# Altium schematic sheet MCU_Core.SchDoc
size A3; SheetNumber: 3; SheetTotal: 5
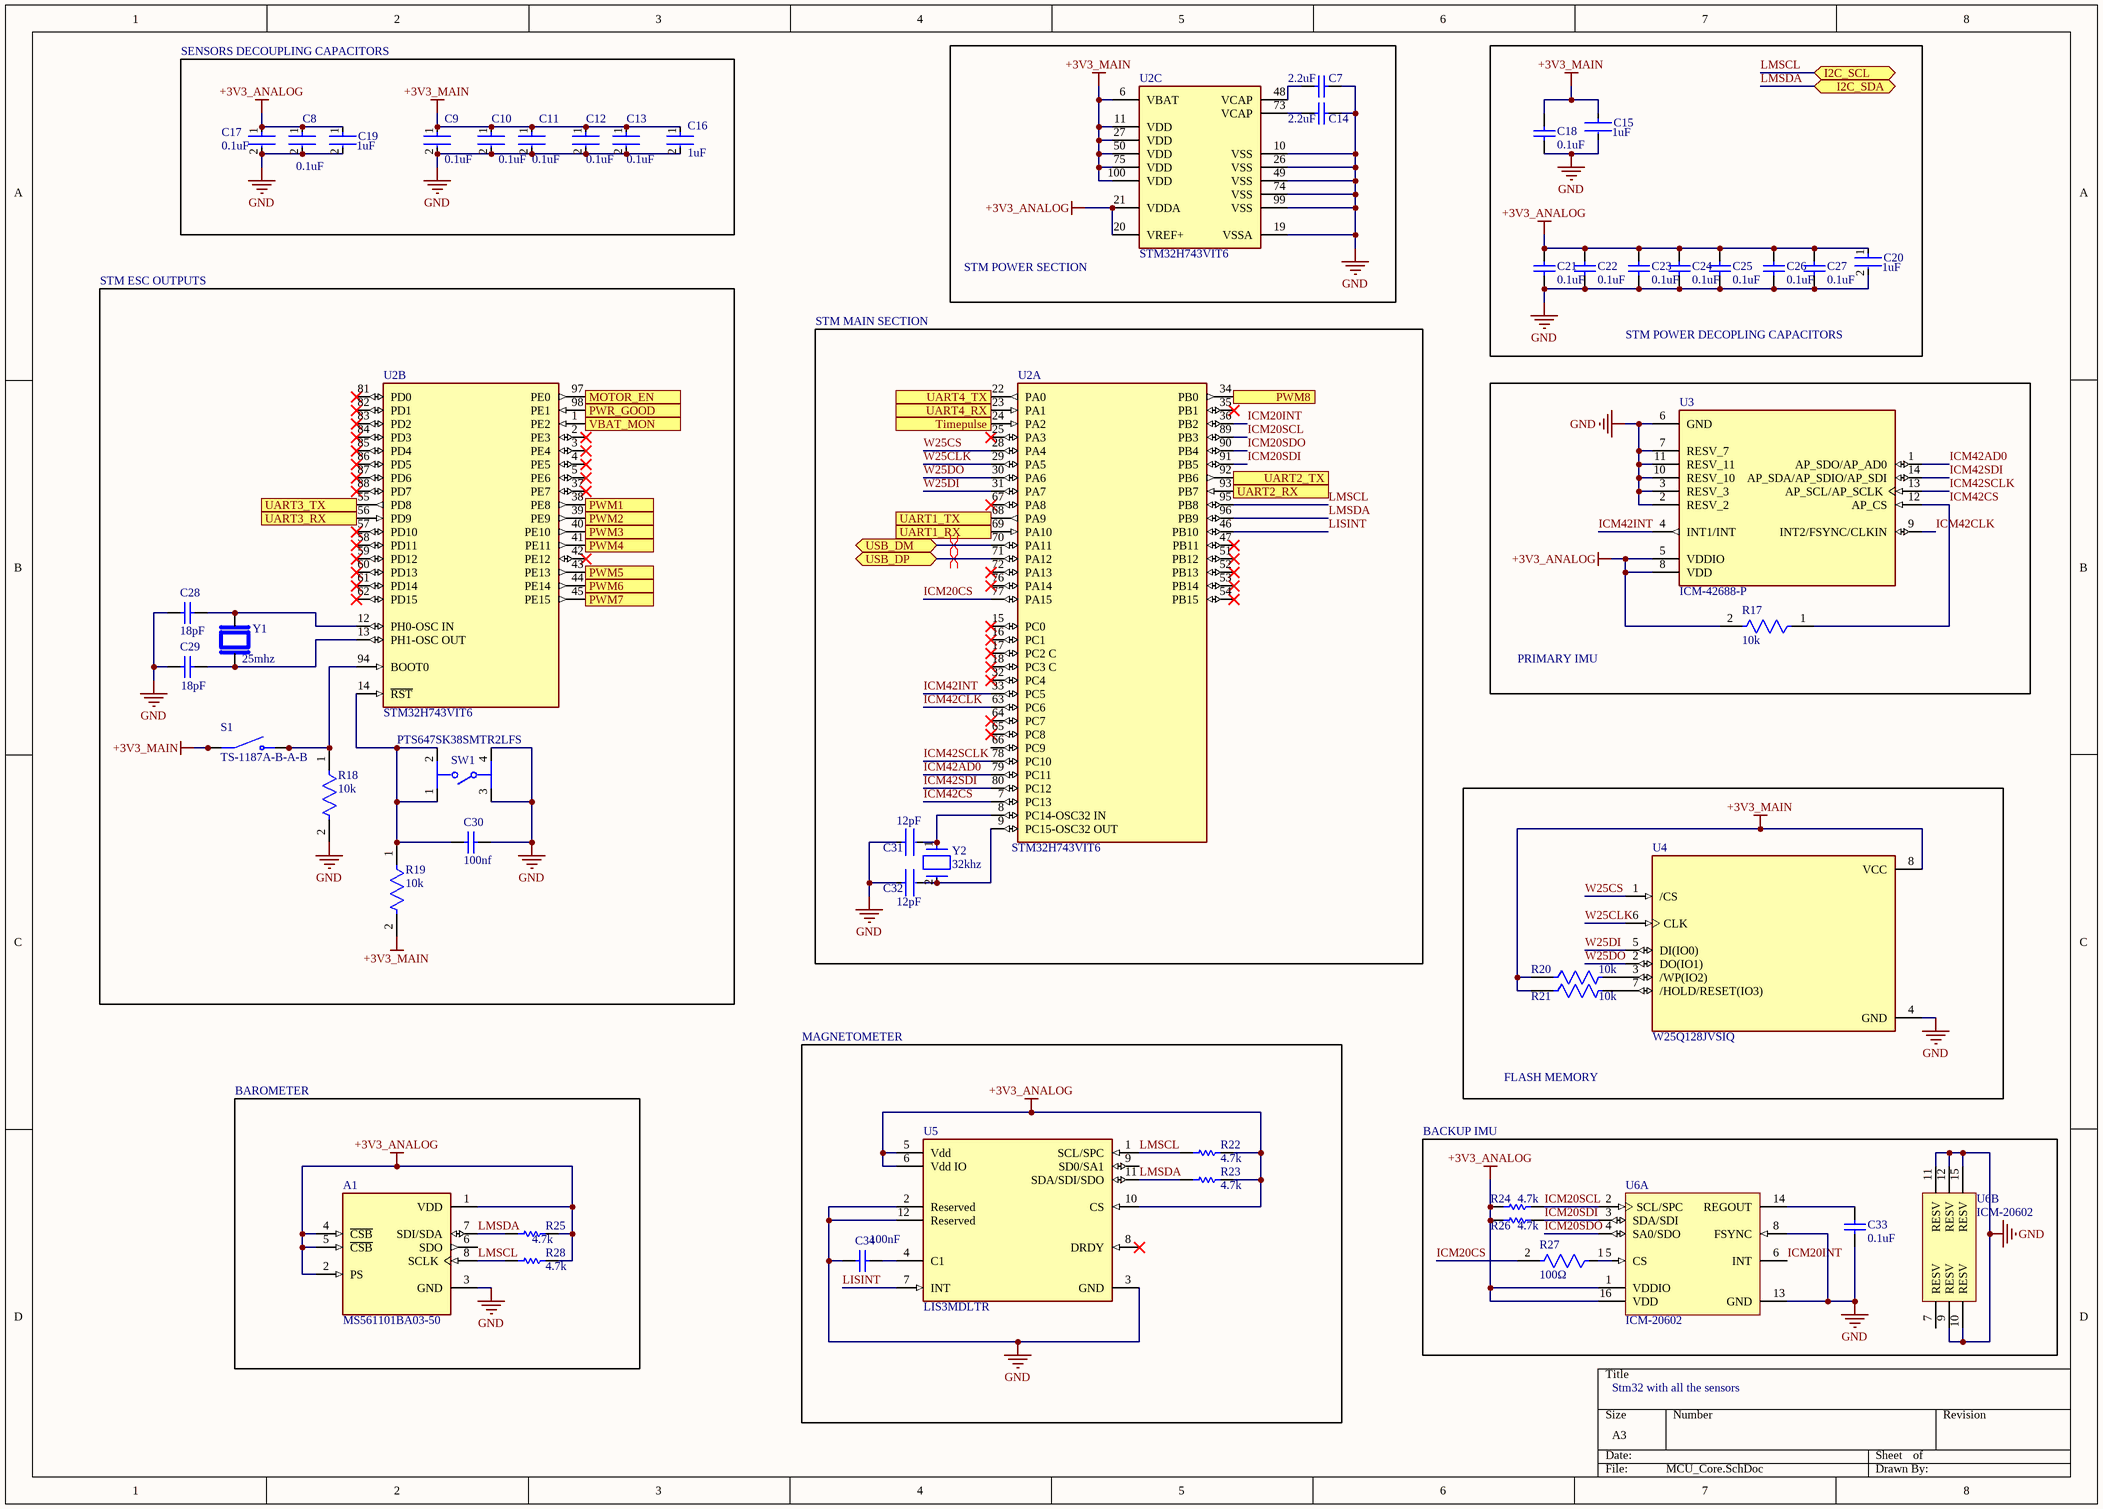
[diagram p0: MCU_Core.SchDoc]

## Parts
A1  MS561101BA03-50  [XDCR_MS561101BA03-50]
C7  2.2uF  [CAPC1608X90X35ML15T15]
C8  0.1uF  [FP-0201-L_0_6_0_05-W_0_3-MFG]
C9  0.1uF  [FP-0201-L_0_6_0_05-W_0_3-MFG]
C10  0.1uF  [FP-0201-L_0_6_0_05-W_0_3-MFG]
C11  0.1uF  [FP-0201-L_0_6_0_05-W_0_3-MFG]
C12  0.1uF  [FP-0201-L_0_6_0_05-W_0_3-MFG]
C13  0.1uF  [FP-0201-L_0_6_0_05-W_0_3-MFG]
C14  2.2uF  [CAPC1608X90X35ML15T15]
C15  1uF  [FP-GCJ21B-0_3-IPC_B]
C16  1uF  [FP-GCJ21B-0_3-IPC_B]
C17  0.1uF  [FP-0201-L_0_6_0_05-W_0_3-MFG]
C18  0.1uF  [CAPC1608X87X35ML15T15]
C19  1uF  [FP-GCJ21B-0_3-IPC_B]
C20  1uF  [FP-GCJ21B-0_3-IPC_B]
C21  0.1uF  [CAPC1608X87X35ML15T15]
C22  0.1uF  [CAPC1608X87X35ML15T15]
C23  0.1uF  [CAPC1608X87X35ML15T15]
C24  0.1uF  [CAPC1608X87X35ML15T15]
C25  0.1uF  [CAPC1608X87X35ML15T15]
C26  0.1uF  [CAPC1608X87X35ML15T15]
C27  0.1uF  [CAPC1608X87X35ML15T15]
C28  18pF  [CAPC1608X92X38NL15T08]
C29  18pF  [CAPC1608X92X38NL15T08]
C30  100nf  [CAPC1608X90X35LL15T15]
C31  12pF  [FP-C0603C-CF-MFG]
C32  12pF  [FP-C0603C-CF-MFG]
C33  0.1uF  [CAPC1608X87X35ML15T15]
C34  100nF  [CAPC1608X87X35ML15T15]
R17  10k  [FP-AC0603-IPC_A]
R18  10k  [FP-MCT0603-IPC_B]
R19  10k  [FP-MCT0603-IPC_B]
R20  10k  [FP-CRGP0805-IPC_C]
R21  10k  [FP-CRGP0805-IPC_C]
R22  4.7k  [RESC3225X75X50ML15T25]
R23  4.7k  [RESC3225X75X50ML15T25]
R24  4.7k  [RESC3225X75X50ML15T25]
R25  4.7k  [RESC3225X75X50ML15T25]
R26  4.7k  [RESC3225X75X50ML15T25]
R27  100Ω  [FP-RMCF0805-IPC_A]
R28  4.7k  [RESC3225X75X50ML15T25]
S1  TS-1187A-B-A-B  [SW_TS-1187A-B-A-B]
SW1  PTS647SK38SMTR2LFS  [FP-PTS647SK38SMTR2LFS-MFG]
U2  STM32H743VIT6  [FP-LQFP100-1L-MFG]  (parts A,B,C of 3)
U3  ICM-42688-P  [PQFN50P300X250X97-14N]
U4  W25Q128JVSIQ  [SOIC127P790X216-8N]
U5  LIS3MDLTR  [FP-VFLGA-12-8365767-MFG]
U6  ICM-20602  [INSE-I62-16]  (parts A,B of 2)
Y1  25mhz  [XTAL_SXT32412BB07-25.000MT]
Y2  32khz  [FP-ABS07-MFG]

## Blocks framed on the sheet
SENSORS DECOUPLING CAPACITORS: C8-C13 C16 C17 C19
STM POWER SECTION: C7 C14 U2
STM POWER DECOPLING CAPACITORS: C15 C18 C20-C27
STM ESC OUTPUTS: C28-C30 R18 R19 S1 SW1 U2 Y1
STM MAIN SECTION: C31 C32 U2 Y2
PRIMARY IMU: R17 U3
FLASH MEMORY: R20 R21 U4
BAROMETER: A1 R25 R28
MAGNETOMETER: C34 R22 R23 U5
BACKUP IMU: C33 R24 R26 R27 U6

## Ports
I2C_SCL (bidir, see EMP_FC_Main[2C], Power_Management[3B]), I2C_SDA (bidir, see EMP_FC_Main[2C], Power_Management[3B]), MOTOR_EN (out, see EMP_FC_Main[3C], Motor_Outputs[2C]), PWM1 (out, see EMP_FC_Main[2C], Motor_Outputs[2B]), PWM2 (out, see EMP_FC_Main[2C], Motor_Outputs[2B]), PWM3 (out, see EMP_FC_Main[2C], Motor_Outputs[2B]), PWM4 (out, see EMP_FC_Main[2C], Motor_Outputs[2B]), PWM5 (out, see EMP_FC_Main[2C], Motor_Outputs[2B]), PWM6 (out, see EMP_FC_Main[2C], Motor_Outputs[2B]), PWM7 (out, see EMP_FC_Main[2C], Motor_Outputs[2B]), PWM8 (out, see EMP_FC_Main[3C], Motor_Outputs[2C]), PWR_GOOD (in, see EMP_FC_Main[2C], Power_Management[8A]), Timepulse (in, see EMP_FC_Main[3B], Communication[3C]), UART1_RX (in, see EMP_FC_Main[2B], Communication[1D]), UART1_TX (out, see EMP_FC_Main[2B], Communication[1D]), UART2_RX (in, see EMP_FC_Main[3B], Communication[1C]), UART2_TX (out, see EMP_FC_Main[3B], Communication[1C]), UART3_RX (in, see EMP_FC_Main[3C], Communication[1B]), UART3_TX (out, see EMP_FC_Main[3B], Communication[1B]), UART4_RX (in, see EMP_FC_Main[3C], Communication[3B]), UART4_TX (out, see EMP_FC_Main[3C], Communication[3B]), USB_DM (bidir, see EMP_FC_Main[2B], Communication[2D]), USB_DP (bidir, see EMP_FC_Main[2B], Communication[2D]), VBAT_MON (in, see EMP_FC_Main[2B], Power_Management[2C])

## Nets
+3V3_ANALOG: A1.1(VDD) A1.2(PS) A1.4(~{CSB}) A1.5(~{CSB}) C8.1 C17.1 C19.1 C20.1 C21.2 C22.2 C23.2 C24.2 C25.2 C26.2 C27.2 R17.2 R22.2 R23.2 R24.2 R25.2 R26.2 R28.2 U2.20(VREF+) U2.21(VDDA) U3.5(VDDIO) U3.8(VDD) U5.5(Vdd) U5.6(Vdd_IO) U5.10(CS) U6.1(VDDIO) U6.16(VDD)
+3V3_MAIN: C9.1 C10.1 C11.1 C12.1 C13.1 C15.1 C16.1 C18.2 R19.2 R20.1 R21.1 S1.A(COM) S1.B(COM) U2.6(VBAT) U2.11(VDD) U2.27(VDD) U2.50(VDD) U2.75(VDD) U2.100(VDD) U4.8(VCC)
GND: A1.3(GND) C7.2 C8.2 C9.2 C10.2 C11.2 C12.2 C13.2 C14.2 C15.2 C16.2 C17.2 C18.1 C19.2 C20.2 C21.1 C22.1 C23.1 C24.1 C25.1 C26.1 C27.1 C28.1 C29.1 C30.1 C31.1 C32.1 C33.1 C34.1 R18.2 SW1.3 SW1.4 U2.10(VSS) U2.19(VSSA) U2.26(VSS) U2.49(VSS) U2.74(VSS) U2.99(VSS) U3.2(RESV_2) U3.3(RESV_3) U3.6(GND) U3.7(RESV_7) U3.10(RESV_10) U3.11(RESV_11) U4.4(GND) U5.2(Reserved) U5.3(GND) U5.12(Reserved) U6.8(FSYNC) U6.9(RESV) U6.10(RESV) U6.11(RESV) U6.12(RESV) U6.13(GND) U6.15(RESV)
ICM20CS: R27.2 U2.77(PA15)
ICM20INT: U2.36(PB2) U6.6(INT)
ICM20SCL: R24.1 U2.89(PB3) U6.2(SCL/SPC)
ICM20SDI: R26.1 U2.91(PB5) U6.3(SDA/SDI)
ICM20SDO: U2.90(PB4) U6.4(SA0/SDO)
ICM42AD0: U2.79(PC11) U3.1(AP_SDO/AP_AD0)
ICM42CLK: U2.63(PC6) U3.9(INT2/FSYNC/CLKIN)
ICM42CS: R17.1 U2.7(PC13) U3.12(AP_CS)
ICM42INT: U2.33(PC5) U3.4(INT1/INT)
ICM42SCLK: U2.78(PC10) U3.13(AP_SCL/AP_SCLK)
ICM42SDI: U2.80(PC12) U3.14(AP_SDA/AP_SDIO/AP_SDI)
LISINT: U2.46(PB10) U5.7(INT)
LMSCL: A1.8(SCLK) R22.1 R28.1 U2.95(PB8) U5.1(SCL/SPC) ; port I2C_SCL
LMSDA: A1.7(SDI/SDA) R23.1 R25.1 U2.96(PB9) U5.11(SDA/SDI/SDO) ; port I2C_SDA
MOTOR_EN: U2.97(PE0) ; port MOTOR_EN
PWM1: U2.38(PE8) ; port PWM1
PWM2: U2.39(PE9) ; port PWM2
PWM3: U2.40(PE10) ; port PWM3
PWM4: U2.41(PE11) ; port PWM4
PWM5: U2.43(PE13) ; port PWM5
PWM6: U2.44(PE14) ; port PWM6
PWM7: U2.45(PE15) ; port PWM7
PWM8: U2.34(PB0) ; port PWM8
PWR_GOOD: U2.98(PE1) ; port PWR_GOOD
Timepulse: U2.24(PA2) ; port Timepulse
UART1_RX: U2.69(PA10) ; port UART1_RX
UART1_TX: U2.68(PA9) ; port UART1_TX
UART2_RX: U2.93(PB7) ; port UART2_RX
UART2_TX: U2.92(PB6) ; port UART2_TX
UART3_RX: U2.56(PD9) ; port UART3_RX
UART3_TX: U2.55(PD8) ; port UART3_TX
UART4_RX: U2.23(PA1) ; port UART4_RX
UART4_TX: U2.22(PA0) ; port UART4_TX
USB_DM: U2.70(PA11) ; port USB_DM
USB_DP: U2.71(PA12) ; port USB_DP
VBAT_MON: U2.1(PE2) ; port VBAT_MON
W25CLK: U2.29(PA5) U4.6(CLK)
W25CS: U2.28(PA4) U4.1(/CS)
W25DI: U2.31(PA7) U4.5(DI(IO0))
W25DO: U2.30(PA6) U4.2(DO(IO1))
NetC7_1: C7.1 U2.48(VCAP)
NetC14_1: C14.1 U2.73(VCAP)
NetC28_2: C28.2 U2.12(PH0-OSC_IN) Y1.3
NetC29_2: C29.2 U2.13(PH1-OSC_OUT) Y1.1
NetC30_2: C30.2 R19.1 SW1.1 SW1.2 U2.14(~{RST})
NetC31_2: C31.2 U2.8(PC14-OSC32_IN) Y2.1
NetC32_2: C32.2 U2.9(PC15-OSC32_OUT) Y2.2
NetC33_2: C33.2 U6.14(REGOUT)
NetC34_2: C34.2 U5.4(C1)
NetR18_1: R18.1 S1.C(NO) S1.D(NO) U2.94(BOOT0)
NetR20_2: R20.2 U4.3(/WP(IO2))
NetR21_2: R21.2 U4.7(/HOLD/RESET(IO3))
NetR27_1: R27.1 U6.5(CS)

Not connected (* = marked no-connect by the designer): A1 6(SDO); U2 2(PE3)* 3(PE4)* 4(PE5)* 5(PE6)* 15(PC0)* 16(PC1)* 17(PC2_C)* 18(PC3_C)* 25(PA3)* 32(PC4)* 35(PB1)* 37(PE7)* 42(PE12)* 47(PB11)* 51(PB12)* 52(PB13)* 53(PB14)* 54(PB15)* 57(PD10)* 58(PD11)* 59(PD12)* 60(PD13)* 61(PD14)* 62(PD15)* 64(PC7)* 65(PC8)* 66(PC9) 67(PA8)* 72(PA13)* 76(PA14)* 81(PD0)* 82(PD1)* 83(PD2)* 84(PD3)* 85(PD4)* 86(PD5)* 87(PD6)* 88(PD7)*; U5 8(DRDY)* 9(SD0/SA1); U6 7(RESV)

## Layout directives
differential pair: USB_DM, USB_DP

## Notes on the sheet
- Stm32 with all the sensors

## Library data of the parts
A1 = MS561101BA03-50: Sensor;MS5611-BT M-CAPS 3X5X1MM T&R;Pressure;MS561101BA03-50 | TE Connectivity MS561101BA03-50; SnapEDA_Link: https://www.snapeda.com/parts/MS561101BA03-50/TE+Connectivity+ALCOSWITCH+Switches/view-part/?ref=snap; Package: SMD-8 Measurement Specialties; Value: *; MF: TE Connectivity; MP: MS561101BA03-50; Check_prices: https://www.snapeda.com/parts/MS561101BA03-50/TE+Connectivity+ALCOSWITCH+Switches/view-part/?ref=eda
C7 C14 = CMP-1035-00163-2: Part Number: 06031A2R2CAT2A; Manufacturer: AVX Interconnect / Elco
C8-C13 C17 = CMP-14477-003761-2: None; Tolerance: 10%; Voltage Rating: 4V; Capacitance: 1uF; Case/Package: 0201; Packaging: Cut Tape; Case Code (Metric): 0603; RoHS Compliant: Yes; Case Code (Imperial): 0201; Max Operating Temperature: 105°C; Min Operating Temperature: -55°C; Mount: Surface Mount
C15 C16 C19 C20 = CMP-06035-032003-1: Multilayer Ceramic Capacitors MLCC - SMD/SMT 0805 1uF 10%, 16VDC,  X8L +15/-40%
C18 C21-C27 C33 C34 = CMP-2006-03295-1: Part Number: C0603T104K3RCLTU; Manufacturer: Kemet
C28 C29 = CMP-2006-01139-1: Part Number: VJ0603A180JXAAC; Manufacturer: Vitramon
C30 = CMP-2006-04391-1: Manufacturer: AVX Interconnect / Elco; Part Number: 06035C104KAZ2A
C31 C32 = CMP-03020-029142-1: C0603 12 pF C0G 30ppm/°C 1.00% 100 V; Manufacturer: KEMET; Manufacturer Part Number: C0603C120F1GACAUTO; Material: Ceramic; Automotive Grade: Grade 1; Voltage Rating: 100 V; Tolerance: 0.01; RoHS: TRUE; Temperature Range High: +125°C; ComponentLink2Description: Datasheet; Height: 0.87mm; ComponentLink2URL: https://api.kemet.com/component-edge/download/datasheet/C0603C100J5GACAUTO.pdf; Capacitance: 12 pF; Package: C0603C-CF; Category: Cap; Device Class L1: Passive Components; Temperature: -55°C to +125°C; Value: 12 pF; Device Class L2: Capacitors; Automotive: Yes; Temperature Characteristic: C0G; Device Class L3: Ceramic Capacitors; Lead Free: Yes; Octopart: https://octopart.com/c0603c120f1gacauto-kemet-91893820; Temperature Coefficient: 30ppm/°C; Temperature Range Low: -55°C
R17 = CMP-03412-040683-1: RES 10kΩ 5.00% 0.2W 0603
R18 R19 = CMP-02407-001090-1: RES SMD 100 OHM 1% 1/8W 0603
R20 R21 = CMP-03211-006861-1: CRGP 0805 10K 1%; Manufacturer Part Number: CRGP0805F10K; Manufacturer: TE; Power Rating: 0.33W; Voltage Rating: 150V; Value: 10KΩ; Tolerance: 0.01; Temperature Coefficient: ±100ppm/°C; ComponentLink2URL: https://www.mouser.com/datasheet/2/418/NG_DS_9-1773463-9_A-1358566.pdf; Temperature Range Low: -55°C; Ipc Land Pattern Name: RESC200125X55; Device Class L2: Resistors; Automotive: No; Device Class L3: Chip SMD Resistors; Composition: Thick Film; Temperature Range High: +155°C; Temperature: -55°C to +155°C; Height: 0.65mm; Series: CRGP; RoHS: TRUE; Device Class L1: Passive Components; Octopart: https://octopart.com/crgp0805f10k-te+connectivity-91018782; Package: CRGP0805; Digikey Description: CRGP 0805 10K 1%; Ambient Temperature Range High: +70°C; Lead Free: Yes; ComponentLink2Description: Datasheet; Category: Res; Resistance: 10KΩ
R22-R26 R28 = CMP-2005-00861-1: Manufacturer: Vishay Dale; Part Number: TNPW12104K70BETA
R27 = CMP-26527-001731-1: 100Ω ±1% 0.125W 0805 Thick Film Chip Resistor AEC-Q200 compliant; Power Rating: 250mW; Temperature Coefficient: 100ppm/°C; Resistance: 100R; Max Power Dissipation: 125mW; Radiation Hardening: No; RoHS Compliant: Yes; Case Code (Imperial): 0805; Depth: 1.25mm; Length: 2mm; Min Operating Temperature: -55°C; Series: RMCF; Packaging: Tape and Reel; Features: Automotive AEC-Q200; Height: 0.026inch; Size Code: 0805; Tolerance: 1%; Number of Terminations: 2; Max Operating Temperature: 155°C; Case/Package: 0805; Width: 0.049inch; Contact Plating: Tin; Resistor Type: Thick Film; Construction: Rectangular; Lead Free: Lead Free; Military Standard: Not; Case Code (Metric): 2012; Mount: Surface Mount
S1 = TS-1187A-B-A-B: SPST 50mA @ 12VDC Top Actuated Round Button 160gf SMD Tactile Switches RoHS; MP: TS-1187A-B-A-B; Value: *; Price: None; Package: None; Availability: Unavailable
SW1 = CMP-10040-000033-1: TACT 4.5 X 4.5, 3.8 MM H, 2.5N,; Switch Function: Off-Mom; Switch Travel: 0.25mm; Actuator Type: Standard; Illumination Type: Non-Illuminated; Mechanical Life: 100000Cycles; Ratings: IP40; Operating Force: 250gf; Throw Configuration: SPST; Max Operating Temperature: 70°C; Min Operating Temperature: -20°C; Termination: Gull Wing; Mount: Surface Mount; Packaging: Tape and Reel
U2 = CMP-12105-000050-1: IC MCU 32BIT 2MB FLASH 100LQFP; Manufacturer: STMicroelectronics; Number Of Ethernet Channels: 1; Number Of Usb Channels: 2; Number Of A/D Converters: 3; Min Supply Voltage: 1.71V; Ram Size: 1060KBytes; Number Of I2C Channels: 4; Frequency: 480MHz; Number Of Adc Channels: 36; Number Of I/Os: 82; Max Supply Voltage: 3.6V; Number Of Spi Channels: 6; Memory Size: 2MBytes; Max Junction Temp: +125°C; Core Architecture: Arm Cortex-M7; Interface: I2C,SPI,UART,USART,USB,LIN,IrDA,Ethernet,I2S,Other; Number Of Timers/Counters: 20; Data Bus Width: 32bits; Number Of Pwm Channels: 42; Number Of Uart Channels: 9; Standoff Height: 0.05mm; Device Class L1: Integrated Circuits (ICs); ComponentLink2URL: https://www.st.com/resource/en/datasheet/stm32h743vi.pdf; Automotive: No; Memory Type: FLASH; Number Of Cores: 1; Temperature Range Low: -40°C; RoHS: TRUE; Ambient Temperature Range Low: -40°C; ComponentLink2Description: Datasheet; Device Class L2: Embedded Processors and Controllers; Device Class L3: Microcontrollers; Digikey Description: IC MCU 32BIT 2MB FLASH 100LQFP; Temperature Range High: +125°C; Ambient Temperature Range High: +85°C; Package: LQFP100-1L; Temperature: -40°C to +125°C; Category: IC; Ipc Land Pattern Name: QFP50P1600X1600X160-100; Height: 1.6mm; Manufacturer Part Number: STM32H743VIT6; Octopart: https://octopart.com/stm32h743vit6-stmicroelectronics-76372527; Lead Free: Yes
U3 = ICM-42688-P: Accelerometer, Gyroscope, 6 Axis Sensor Output; Package: None; MP: ICM-42688-P; Value: *; Availability: Unavailable; Price: None
U4 = W25Q128JVSIQ: FLASH - NOR Memory IC 128Mb (16M x 8) SPI - Quad I/O, QPI, DTR 133 MHz 8-SOIC; MF: Winbond Electronics; SnapEDA_Link: https://www.snapeda.com/parts/W25Q128JVSIQ/Winbond/view-part/?ref=snap; Package: SOIC-8 Winbond Electronics; Value: *; MP: W25Q128JVSIQ; Check_prices: https://www.snapeda.com/parts/W25Q128JVSIQ/Winbond/view-part/?ref=eda
U5 = CMP-2000-07463-2: SENSOR MR I2C/SPI 12LGA; Manufacturer: STMicroelectronics; Sensor Output: I2C,SPI; Operating Supply Current: 40-270uA; Max Supply Voltage: 3.6V; Sensing Method: Magnetic; Min Supply Voltage: 1.71V; ComponentLink2URL: https://www.st.com/resource/en/datasheet/lis3mdl.pdf; Category: IC; Manufacturer Part Number: LIS3MDLTR; Octopart: https://octopart.com/lis3mdltr-stmicroelectronics-29403125; Automotive: No; ComponentLink2Description: Datasheet; RoHS: TRUE; Device Class L3: unset; Device Class L1: Sensors; Temperature: -40°C to +85°C; Height: 1mm; Mouser Description: Board Mount Hall Effect / Magnetic Sensors Ultra Lo-Pwr Hi Perf 3-Axis 1.9-3.6V; Temperature Range High: +85°C; Lead Free: Yes; Device Class L2: Magnetic Sensors; Footprint Url: https://www.st.com/content/ccc/resource/technical/document/technical_note/73/17/9c/16/dd/96/4a/01/CD00134799.pdf/files/CD00134799.pdf/jcr:content/translations/en.CD00134799.pdf; Temperature Range Low: -40°C; Package: VFLGA-12-8365767; Digikey Description: SENSOR MR I2C/SPI 12LGA
U6 = CMP-2000-07589-1: High Performance 6-Axis MEMS MotionTracking(TM) Device, 1.71 to 3.45 V, -40 to 85 degC, 16-Pin LGA, RoHS; Manufacturer: InvenSense; Sensor Type: Temperature; Output Type: I2C; RoHSCompliant: True; Datasheet Version: Rev. 1.0, 10/2016; Datasheet URL: http://www.invensense.com/wp-content/uploads/2016/10/DS-000176-ICM-20602-v1.0.pdf; Min Operating Temperature: -40degC; Mounting Technology: SurfaceMount; Max Operating Temperature: 85degC; Manufacturer URL: http://www.invensense.com/; Package Reference: I62-16; Package Description: 16-Pin Land Grid Array, Body 3 x 3 mm, Pitch 0.5 mm
Y1 = SXT32412BB07-25.000MT: 25 MHz Â±30ppm Crystal 12pF 50 Ohms 4-SMD, No Lead; MF: Suntsu; SnapEDA_Link: https://www.snapeda.com/parts/SXT32412BB07-25.000M/Suntsu/view-part/?ref=snap; Package: NON STANDARD-4 Suntsu; Value: *; MP: SXT32412BB07-25.000M; Check_prices: https://www.snapeda.com/parts/SXT32412BB07-25.000M/Suntsu/view-part/?ref=eda
Y2 = CMP-0447-00001-4: Crystal 32.768kHz ±20ppm (Tol) 12.5pF FUND 70kΩ 2-Pin CSMD T/R; ESR (Equivalent Series Resistance): 70kR; Radiation Hardening: No; Frequency: 32.768kHz; Length: 3.2mm; Max Operating Temperature: 85°C; Number of Pins: 2; Series: ABS07; Min Operating Temperature: -40°C; Frequency Tolerance: 20ppm; Packaging: Tape and Reel; Height: 0.9mm; Width: 1.5mm; Depth: 1.5mm; Load Capacitance: 12.5pF; RoHS Compliant: Yes; Tolerance: 20ppm; Termination: SMD/SMT; Lead Free: Lead Free; Series Resistance: 70kR; REACH SVHC: No SVHC; Case/Package: CSMD; Operating Frequency: 32.768 kHz; Package Quantity: 3000